# Altium schematic sheet Kajtuś-DSP_digital_in.SchDoc
size A4; DocumentNumber: 2; SheetNumber: 2; SheetTotal: 9
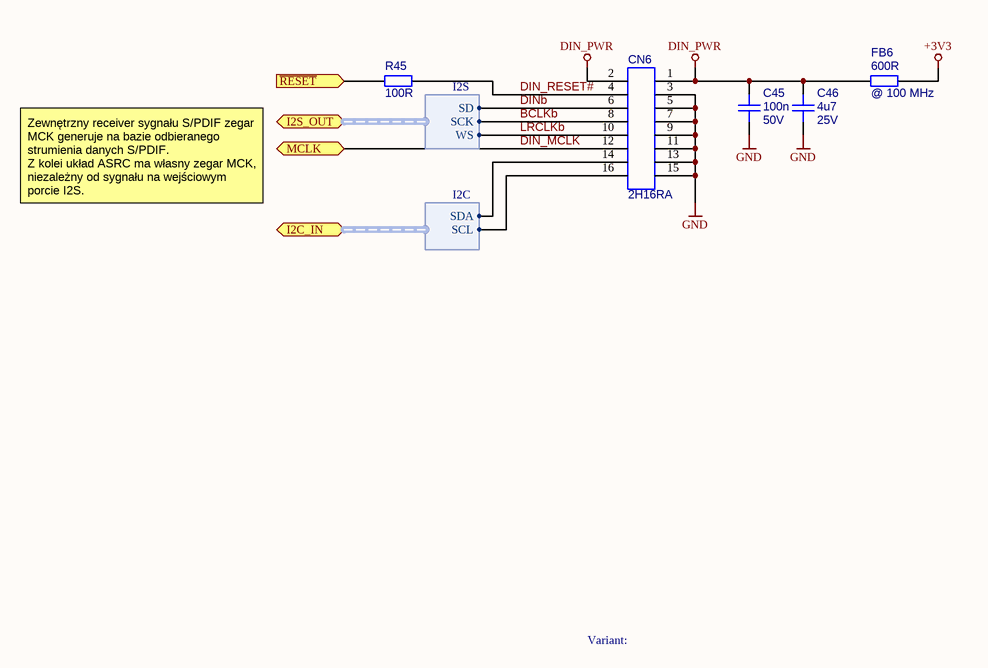
[diagram p0: Kajtuś-DSP_digital_in.SchDoc]

## Parts
C45  value 100n  Voltage: 50V  [C_0603_MA]  (hidden comment: C_0603_100n_50V_X7R)
C46  value 4u7  Voltage: 25V  [C_1206_MA]  (hidden comment: C_1206_4u7_25V_X7R)
CN6  2H16RA  [CN_2H16RA_WE_WR-PHD_61301621021]
FB6  value 600R  @ Frequency: @ 100 MHz  [R_0603_MA]  (hidden comment: FB_0603_PBY160808T-601Y_600R_1A)
R45  value 100R  [R_0603_MA]  (hidden comment: R_0603_100R_5%)

## Ports
I2C_IN (harness I2C), I2S_OUT (harness I2S), MCLK, ~{RESET} (in)

## Harnesses
I2S: SD, SCK, WS
I2C: SDA, SCL

## Nets
+3V3: FB6.2
DIN_PWR: C45.1 C46.1 CN6.1 CN6.2 FB6.1
GND: C45.2 C46.2 CN6.3 CN6.5 CN6.7 CN6.9 CN6.11 CN6.13 CN6.15
BCLKb: CN6.8 ; port I2S_OUT.SCK
DIN_MCLK: CN6.12 ; port MCLK
DIN_RESET#: CN6.4 R45.2
DINb: CN6.6 ; port I2S_OUT.SD
LRCLKb: CN6.10 ; port I2S_OUT.WS
~{RESET}: R45.1 ; port ~{RESET}
NetCN6_14: CN6.14 ; port I2C_IN.SDA
NetCN6_16: CN6.16 ; port I2C_IN.SCL

## Notes on the sheet
- Zewnętrzny receiver sygnału S/PDIF zegar MCK generuje na bazie odbieranego strumienia danych S/PDIF.
  Z kolei układ ASRC ma własny zegar MCK, niezależny od sygnału na wejściowym porcie I2S.
- Variant:
- Title
- Size:
- Date:
- A4
- Number:
- Time:
- Revision:
- Sheet
- of
- File:

## Library data of the parts
C45 = C_0603_100n_50V_X7R: Kondensator ceramiczny SMD; Vendor: TME; Part Number: C_0603_100n_50V_X7R
C46 = C_1206_4u7_25V_X7R: Kondensator ceramiczny SMD; Manufacturer: AVX, KEMET; Vendor: TME; Part Number: C_1206_4u7_25V_X7R
CN6 = CN_2H16RA: Listwa kołkowa; Manufacturer: Ninigi; Vendor: TME; Part Number: CN_2H16RA; Value: 2H16RA
FB6 = FB_0603_PBY160808T-601Y_600R_1A: Koralik ferrytowy; Manufacturer: Yageo; Vendor: TME; Part Number: FB_0603_PBY160808T-601Y_600R_1A; Vendor Part Name: PBY160808T-601Y; Manufacturer Part Number: PBY160808T-601Y
R45 = R_0603_100R_5%: Rezystor SMD; Manufacturer: Royal Ohm; Vendor: TME; Tolerance: 5%; Part Number: R_0603_100R_5%